# Altium schematic sheet Power_Supply_and_Buttons.SchDoc
size A4
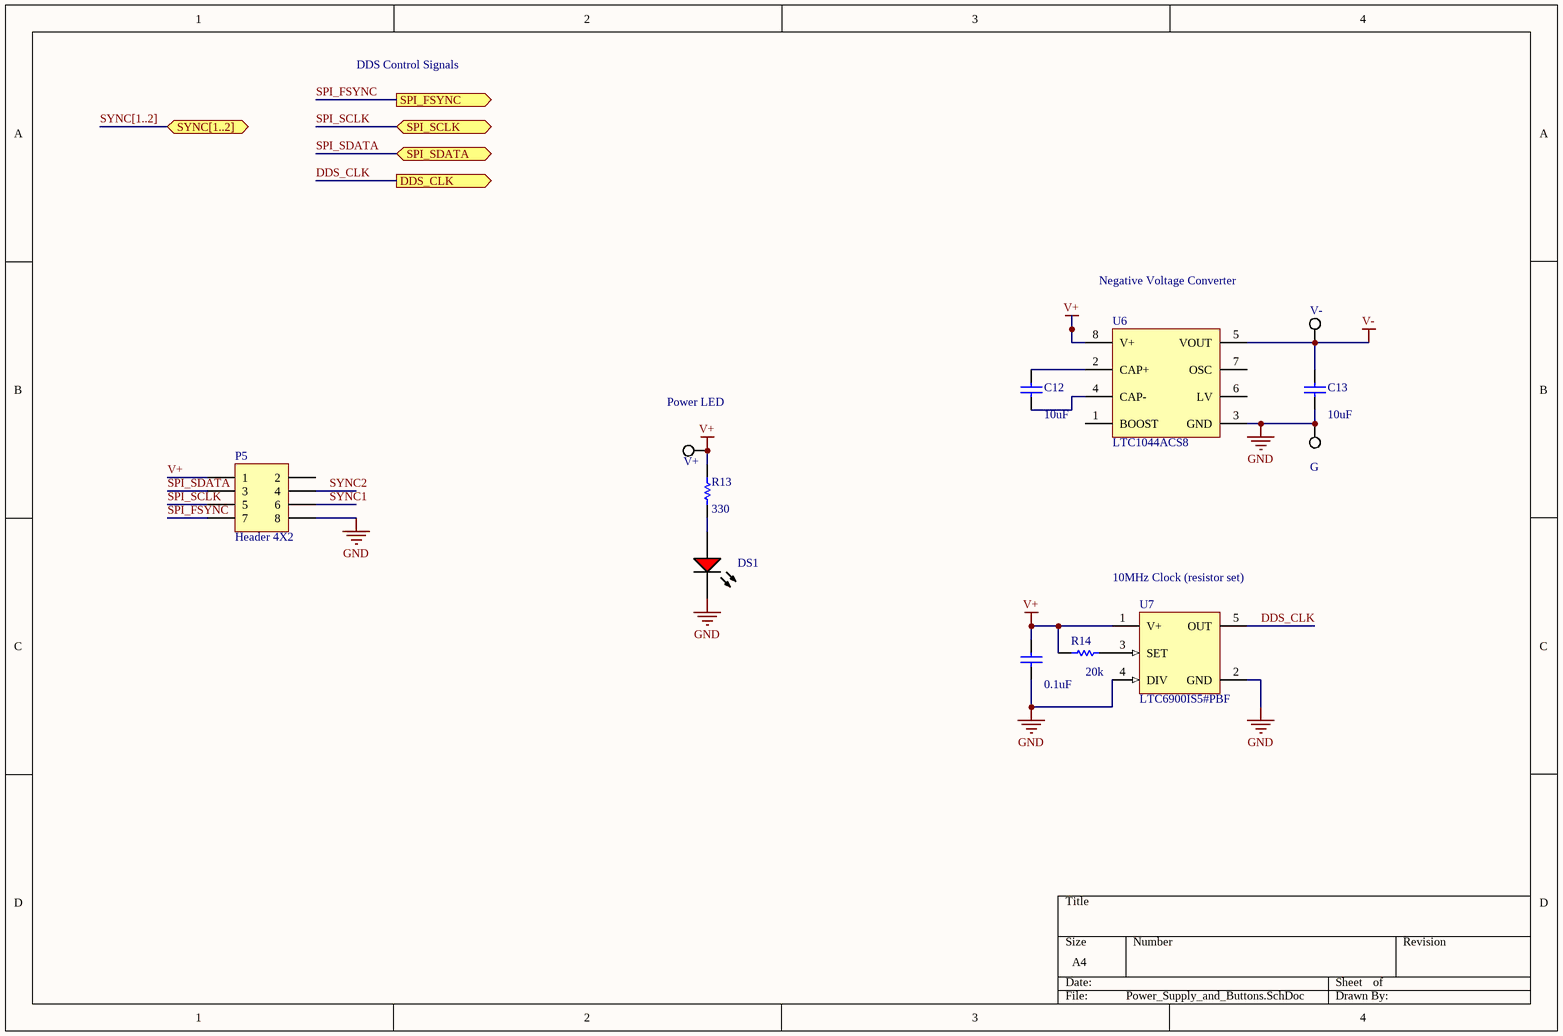
[diagram p0: Power_Supply_and_Buttons.SchDoc]

## Parts
C12  10uF  [1608[0603]]
C13  10uF  [1608[0603]]
C14  0.1uF  [1608[0603]]
DS1  TLMS1100-GS08  [VISH-TLMX1100_V]  (value not drawn)
G  TESTPOINT_WHITE  [TestPointVia]  (value not drawn)
P5  Header 4X2  [HDR2X4]
R13  330  [6-0805_M]
R14  20k  [6-0805_M]
U6  LTC1044ACS8  [LT-S8-8_M]
U7  LTC6900IS5#PBF  [LT-TSOT-23-5_V]
V+  TESTPOINT_WHITE  [TestPointVia]  (value not drawn)
V-  TESTPOINT_WHITE  [TestPointVia]  (value not drawn)

## Ports
DDS_CLK (out), SPI_FSYNC (out), SPI_SCLK (bidir), SPI_SDATA (bidir), SYNC[1..2] (bidir)

## Nets
GND: C13.1 C14.1 DS1.2(K) G.1 P5.8 U6.3(GND) U7.2(GND) U7.4(DIV)
V+: C14.2 P5.1 R13.2 R14.1 U6.8(V+) U7.1(V+) V+.1
V-: C13.2 U6.5(VOUT) V-.1
DDS_CLK: U7.5(OUT) ; port DDS_CLK
SPI_FSYNC: P5.7 ; port SPI_FSYNC
SPI_SCLK: P5.5 ; port SPI_SCLK
SPI_SDATA: P5.3 ; port SPI_SDATA
SYNC1: P5.6
SYNC2: P5.4
NetC12_1: C12.1 U6.4(CAP-)
NetC12_2: C12.2 U6.2(CAP+)
NetDS1_1: DS1.1(A) R13.1
NetR14_2: R14.2 U7.3(SET)

Not connected (* = marked no-connect by the designer): P5 2; U6 1(BOOST) 6(LV) 7(OSC)

## Buses and harness runs
bus SYNC[1..2] = port SYNC[1..2]

## Notes on the sheet
- DDS Control Signals
- Negative Voltage Converter
- (near V+) Power LED
- (near U7) 10MHz Clock (resistor set)

## Library data of the parts
C12-C14 = Cap Semi: Capacitor (Semiconductor SIM Model); Published: 8-Jun-2000; LatestRevisionDate: 29-May-2009; LatestRevisionNote: IPC-7351 Footprint Added.; PackageReference: C1206; Publisher: Altium Limited; PackageDescription: Chip Capacitor
  C12 C13: Value: 10uF
  C14: Value: 0.1uF
DS1 = CMP-1666-00027-1: LED, RED, 2.1 V, -40 to 100 degC, 2-Pin SMD (0603), RoHS, Tape and Reel; Type (Capacitors): C0G; Resistance: 100000000000 Ohm; Capacitance: 12 pF; Voltage Rating: 50 V; Tolerance: 5%; Min Operating Temperature: -55degC; REACH SVHC: No SVHC; ComponentLink2Description: Datasheet; ComponentLink1URL: http://www.vishay.com/; Width: 0.8 mm; Package Quantity: 4000; PackageReference: TLMX1100; ComponentLink2URL: http://www.vishay.com/docs/83173/tlmb1100.pdf; Case/Package: 0603; Case Code (Metric): 1608; Packaging: Tape and Reel; Pins: 2; ComponentLink1Description: Manufacturer URL; Max Operating Temperature: 125degC; Height: 0.8 mm; Length: 1.6 mm; Mount: Surface Mount; PackageDescription: 2-Pin Surface Mount Device, Body 1.6 x 0.8 mm; DatasheetVersion: Rev. 2.7, 03/2016; Case Code (Imperial): 0603; Voltage Rating (DC): 50 V; RoHSCompliant: True; Radiation Hardening: No
P5 = Header 4X2: Header, 4-Pin, Dual row; LatestRevisionDate: 17-Jul-2002; LatestRevisionNote: Re-released for DXP Platform.; Publisher: Altium Limited
R13 R14 = Res1: Resistor; Published: 8-Jun-2000; LatestRevisionDate: 17-Jul-2002; LatestRevisionNote: Re-released for DXP Platform.; PackageReference: AXIAL-0.3; Publisher: Altium Limited; PackageDescription: Axial Device, Thru-Hole; 2 Leads; 0.3 in Pin Spacing
  R13: Value: 330
  R14: Value: 20k
U6 = CMP-0475-00491-1: 12 V CMOS Voltage Converter, 8-pin SOIC (S8-8), 0 to 70 degC; Manufacturer: Linear Technology; Isupply(mA): 0.2; Voutput: 2Vin, -Vin, 0.5Vin; Vin Max(V): 12; Frequency(kHz): 5; Max Iout(mA): 20; Vin Min(V): 1.5; ComponentLink1Description: Manufacturer URL; PartNumber: LTC1044ACS8; PackageVersion: Rev. G, 03/2012; ComponentLink2URL: http://cds.linear.com/docs/en/datasheet/lt1044a.pdf; PackageReference: S8-8; ComponentLink2Description: Datasheet; DatasheetVersion: Rev. 0; RoHS: FALSE; PackageDescription: 8-Pin Plastic Small Outline (Narrow .150 Inch), Body 4.9 x 3.9 mm, Pitch 1.27 mm; ComponentLink3Description: Package Specification; Mounting Technology: Surface Mount; ComponentLink3URL: http://cds.linear.com/docs/en/packaging/05081610_G_SO8.pdf; ComponentLink1URL: http://www.linear.com/
U7 = CMP-2000-06612-1: Low Power, Resistor Set Oscillator, 1 KHz to 20 MHz, 2.7 to 5.5 V, -40 to 85 degC, 5-Pin SOT-23 (S5), Pb-Free; Manufacturer: Linear Technology; Frequency: 20MHz; Supply Voltage Range: 2.7Vto5.5V; Supply Voltage Min: 2.7V; Supply Voltage Max: 5.5V; Base Number: 6900; SVHC: NoSVHC(19-Dec-2012); No. of Pins: 5; Clock External Input: No; Operating Temperature Min: -40°C; Operating Temperature Range: -40°Cto+85°C; Manufacturer URL: http://www.linear.com/; Operating Frequency Max: 20MHz; Package Description: 5-Pin Small Outline Transistor, Body 2.9 x 1.625 mm, Pitch 0.95 mm; Operating Temperature Max: 85°C; MSL: MSL1-Unlimited; Datasheet Version: Rev. A, 07/2009; Package / Case: SOT-23; Datasheet URL: http://cds.linear.com/docs/en/datasheet/6900fa.pdf; Termination Type: SMD; Package Reference: TSOT23-5; Mounting Technology: SurfaceMount; Digital IC Case Style: SOT-23